# Altium schematic sheet Controller.SchDoc
size A4
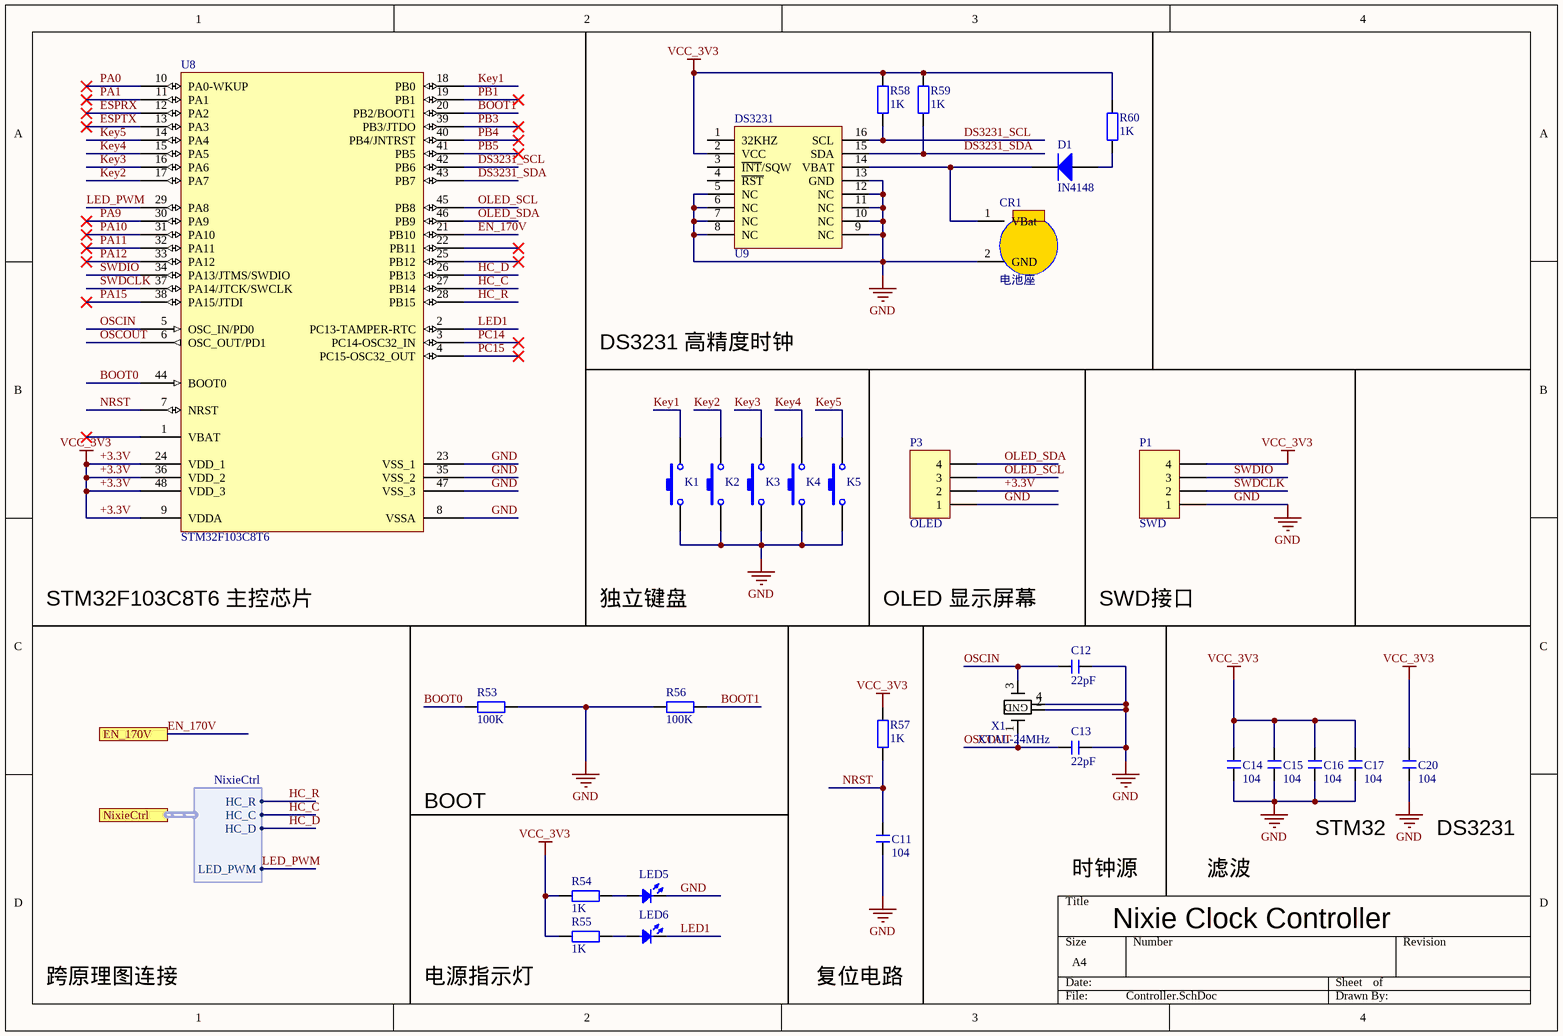
[diagram p0: Controller.SchDoc]

## Parts
C11  104  [C 0603]
C12  22pF  [C 0603]
C13  22pF  [C 0603]
C14  104  [C 0603]
C15  104  [C 0603]
C16  104  [C 0603]
C17  104  [C 0603]
C20  104  [C 0603]
CR1  电池座  [BAT-2P]
D1  IN4148  [0805D]
K1  按键  [TSW 3*6*4.3-S-W]  (value not drawn)
K2  按键  [TSW 3*6*4.3-S-W]  (value not drawn)
K3  按键  [TSW 3*6*4.3-S-W]  (value not drawn)
K4  按键  [TSW 3*6*4.3-S-W]  (value not drawn)
K5  按键  [TSW 3*6*4.3-S-W]  (value not drawn)
LED5  LED  [0805D]  (value not drawn)
LED6  LED  [0805D]  (value not drawn)
P1  SWD  [HDR1X4]
P3  OLED  [HDR1X4]
R53  100K  [R 0603]
R54  1K  [R 0603]
R55  1K  [R 0603]
R56  100K  [R 0603]
R57  1K  [R 0603]
R58  1K  [R 0603]
R59  1K  [R 0603]
R60  1K  [R 0603]
U8  STM32F103C8T6  [LQFP48 7X7_M]
U9  DS3231  [SOL-16]
X1  XTAL-24MHz  [XTAL-3225]

## Ports
EN_170V, NixieCtrl (harness NixieCtrl)

## Harnesses
NixieCtrl: HC_R, HC_C, HC_D, LED_PWM

## Nets
+3.3V: C14.1 C15.1 C16.1 C17.1 C20.2 P1.4 P3.2 R54.1 R55.1 R57.2 R58.2 R59.2 R60.1 U8.9(VDDA) U8.24(VDD_1) U8.36(VDD_2) U8.48(VDD_3) U9.2(VCC)  [also labelled VCC_3V3]
GND: C11.1 C12.2 C13.2 C14.2 C15.2 C16.2 C17.2 C20.1 CR1.2(GND) K1.1 K2.1 K3.1 K4.1 K5.1 LED5.2(K) P1.1 P3.1 R53.2 R56.1 U8.8(VSSA) U8.23(VSS_1) U8.35(VSS_2) U8.47(VSS_3) U9.5(NC) U9.6(NC) U9.7(NC) U9.8(NC) U9.9(NC) U9.10(NC) U9.11(NC) U9.12(NC) U9.13(GND) X1.2 X1.4
BOOT0: R53.1 U8.44(BOOT0)
BOOT1: R56.2 U8.20(PB2/BOOT1)
DS3231_SCL: R58.1 U8.42(PB6) U9.16(SCL)
DS3231_SDA: R59.1 U8.43(PB7) U9.15(SDA)
EN_170V: U8.21(PB10) ; port EN_170V
ESPRX: U8.12(PA2)
ESPTX: U8.13(PA3)
HC_C: U8.27(PB14) ; port NixieCtrl.HC_C
HC_D: U8.26(PB13) ; port NixieCtrl.HC_D
HC_R: U8.28(PB15) ; port NixieCtrl.HC_R
Key1: K1.2 U8.18(PB0)
Key2: K2.2 U8.17(PA7)
Key3: K3.2 U8.16(PA6)
Key4: K4.2 U8.15(PA5)
Key5: K5.2 U8.14(PA4)
LED1: LED6.2(K) U8.2(PC13-TAMPER-RTC)
LED_PWM: U8.29(PA8) ; port NixieCtrl.LED_PWM
NRST: C11.2 R57.1 U8.7(NRST)
OLED_SCL: P3.3 U8.45(PB8)
OLED_SDA: P3.4 U8.46(PB9)
OSCIN: C12.1 U8.5(OSC_IN/PD0) X1.3(GND)
OSCOUT: C13.1 U8.6(OSC_OUT/PD1) X1.1
PA0: U8.10(PA0-WKUP)
PA1: U8.11(PA1)
PA9: U8.30(PA9)
PA10: U8.31(PA10)
PA11: U8.32(PA11)
PA12: U8.33(PA12)
PA15: U8.38(PA15/JTDI)
PB1: U8.19(PB1)
PB3: U8.39(PB3/JTDO)
PB4: U8.40(PB4/JNTRST)
PB5: U8.41(PB5)
PC14: U8.3(PC14-OSC32_IN)
PC15: U8.4(PC15-OSC32_OUT)
SWDCLK: P1.2 U8.37(PA14/JTCK/SWCLK)
SWDIO: P1.3 U8.34(PA13/JTMS/SWDIO)
NetCR1_1: CR1.1(VBat) D1.2(K) U9.14(VBAT)
NetD1_1: D1.1(A) R60.2
NetLED5_1: LED5.1(A) R54.2
NetLED6_1: LED6.1(A) R55.2

Not connected (* = marked no-connect by the designer): U8 1(VBAT)* 22(PB11)* 25(PB12)*; U9 1(32KHZ) 3(~{INT}/SQW) 4(~{RST})

## Notes on the sheet
- DS3231 高精度时钟
- STM32F103C8T6 主控芯片
- 独立键盘
- OLED 显示屏幕
- SWD接口
- BOOT
- STM32
- DS3231
- 时钟源
- 滤波
- 跨原理图连接
- 电源指示灯
- 复位电路
- Nixie Clock Controller

## Library data of the parts
C11-C17 C20 = C: 无极性贴片电容; 版权归属: 源创客; BOM名称: 无极性贴片电容; 学习资源: www.ooocke.com
CR1 = CR2032 电池座
D1 = 二级管
P1 P3 = Header 4: Header, 4-Pin; LatestRevisionDate: 17-Jul-2002; LatestRevisionNote: Re-released for DXP Platform.; Publisher: Altium Limited
R53-R60 = R: 贴片电阻; 版权归属: 源创客; BOM名称: 贴片电阻; 学习资源: www.ooocke.com
U8 = STM32F103C8T6: Flaah:64/RAM:20/IO:36; BOM名称: 32位STM单片机; 版权归属: 源创客; 学习资源: www.ooocke.com
X1 = XTAL-SMD
LED5 LED6 = LED: Published: 8-Jun-2000; LatestRevisionDate: 08-Jul-2005; LatestRevisionNote: Mech Layer 1 removed.; PackageReference: LED-0; Publisher: Altium Limited; PackageDescription: LED; 2 Leads